# EAGLE design VentaConnected_ESP8266_V1.0_2018-10-06 (EAGLE 8.5.0)
VERSION: 0.01
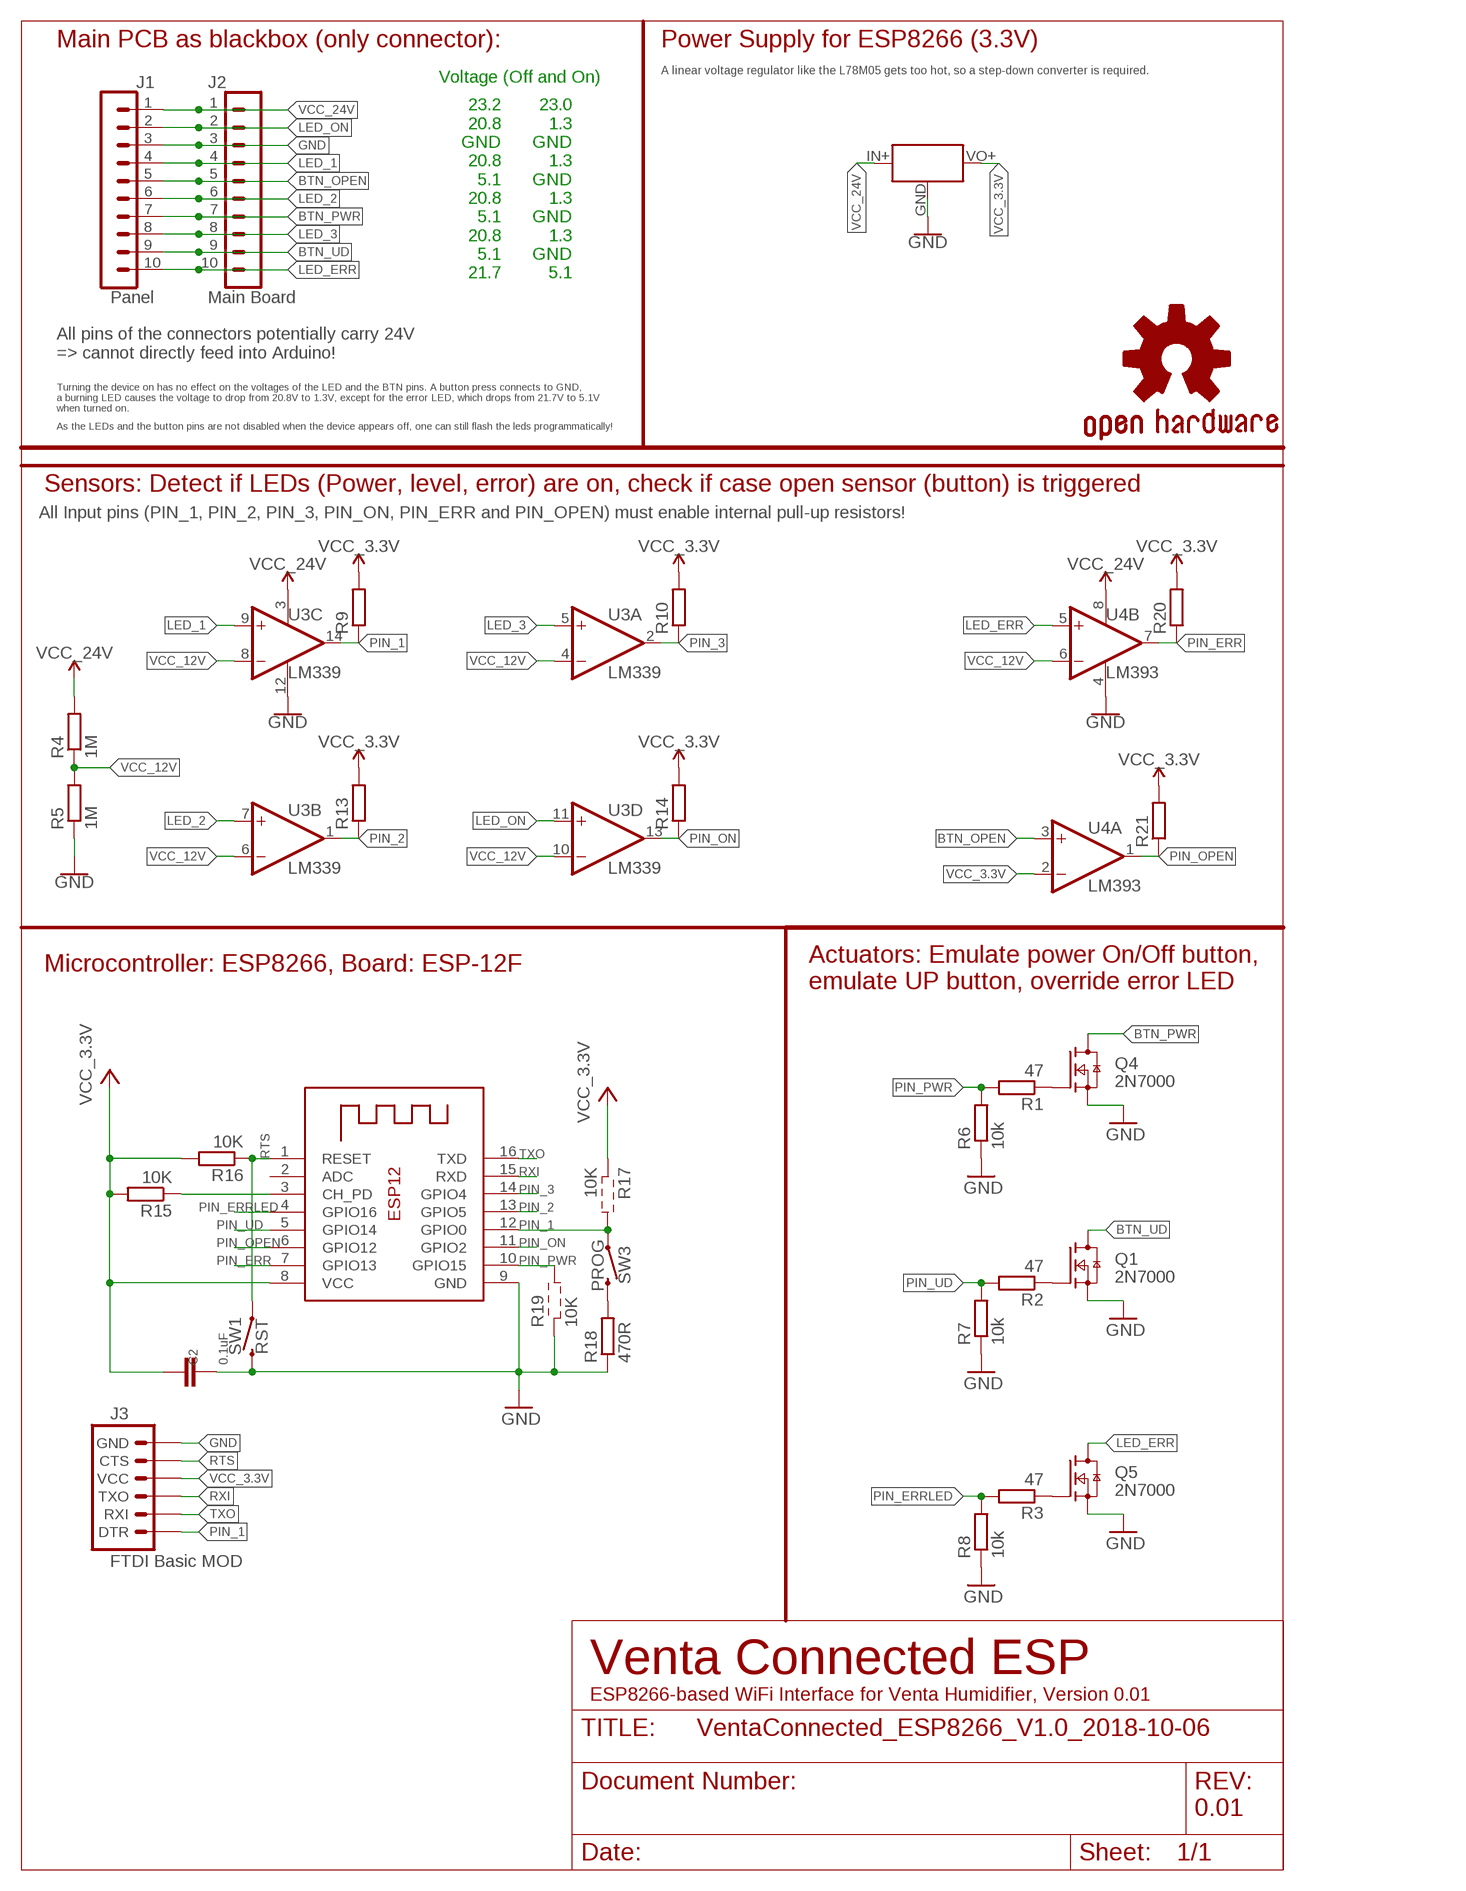
[diagram p0: schematic, sheet 1]

## Parts
C2  0.1uF  C-EUC0805  [C0805]
GOLD_ORB_SM1  OSHWLOGO_GOLD_ORB_SM  [OSHW2]
J1  Panel  CONN_05X2SHD  [2X5-SHROUDED]
J2  Main Board  CONN_05X2PTH  [2X5]
J3  FTDI Basic MOD  ARDUINO_SERIAL_PROGRAMPTH  [1X06]
Q1  2N7000  2N7002E  [SOT23]
Q4  2N7000  2N7002E  [SOT23]
Q5  2N7000  2N7002E  [SOT23]
R1  47  R-EU_R0805  [R0805]
R2  47  R-EU_R0805  [R0805]
R3  47  R-EU_R0805  [R0805]
R4  1M  R-EU_R0805  [R0805]
R5  1M  R-EU_R0805  [R0805]
R6  10k  R-EU_R0805  [R0805]
R7  10k  R-EU_R0805  [R0805]
R8  10k  R-EU_R0805  [R0805]
R9  R-EU_R0805  [R0805]
R10  R-EU_R0805  [R0805]
R13  R-EU_R0805  [R0805]
R14  R-EU_R0805  [R0805]
R15  10K  R-EU_R0805  [R0805]
R16  10K  R-EU_R0805  [R0805]
R17  10K  R-EU_HIDDEN  (no package)
R18  470R  R-EU_R0805  [R0805]
R19  10K  R-EU_HIDDEN  (no package)
R20  R-EU_R0805  [R0805]
R21  R-EU_R0805  [R0805]
SW1  RST  MOMENTARY-SWITCH-SPST-SMD-6.0X3.5MM  [TACTILE_SWITCH_SMD_6.0X3.5MM]
SW3  PROG  MOMENTARY-SWITCH-SPST-SMD-6.0X3.5MM  [TACTILE_SWITCH_SMD_6.0X3.5MM]
U2  3.3V_BUCK_CONVERTER  MINI_BUCK_CONVERTER_UPSIDEDOWN  [MINI_BUCK_CONVERTER_UPDOWN]
U3  LM339  TLC339D  [SO14]
U4  LM393  LM393D  [SO08]
X2  ESP-12e  ESP-12  [ESP-12]

## Nets
BTN_OPEN: J1.5 J2.5 U4.3(A:+IN)
BTN_PWR: J1.7 J2.7 Q4.3(D)
BTN_UD: J1.9 J2.9 Q1.3(D)
CH_PD: R15.1 X2.3(CH_PD)
GND: C2.1 J1.3 J2.3 J3.6(GND) Q1.2(S) Q4.2(S) Q5.2(S) R5.1 R6.1 R7.1 R8.1 R18.1 R19.1 SW1.2 U2.GND U3.12(P:V-) U4.4(P:V-) X2.9(GND)
LED_1: J1.4 J2.4 U3.9(C:+IN)
LED_2: J1.6 J2.6 U3.7(B:+IN)
LED_3: J1.8 J2.8 U3.5(A:+IN)
LED_ERR: J1.10 J2.10 Q5.3(D) U4.5(B:+IN)
LED_ON: J1.2 J2.2 U3.11(D:+IN)
N$2: Q4.1(G) R1.1
N$4: R18.2 SW3.2
N$5: Q5.1(G) R3.1
N$6: Q1.1(G) R2.1
PIN_1: J3.1(DTR) R9.1 R17.2 SW3.1 U3.14(C:OUT) X2.12(GPIO0)
PIN_2: R13.1 U3.1(B:OUT) X2.13(GPIO5)
PIN_3: R10.1 U3.2(A:OUT) X2.14(GPIO4)
PIN_ERR: R20.1 U4.7(B:OUT) X2.7(GPIO13)
PIN_ERRLED: R3.2 R8.2 X2.4(GPIO16)
PIN_ON: R14.1 U3.13(D:OUT) X2.11(GPIO2)
PIN_OPEN: R21.1 U4.1(A:OUT) X2.6(GPIO12)
PIN_PWR: R1.2 R6.2 R19.2 X2.10(GPIO15)
PIN_UD: R2.2 R7.2 X2.5(GPIO14)
RTS: J3.5(CTS) R16.1 SW1.1 X2.1(RESET)
RXI: J3.3(TXO) X2.15(RXD)
TXO: J3.2(RXI) X2.16(TXD)
VCC_3.3V: C2.2 J3.4(VCC) R9.2 R10.2 R13.2 R14.2 R15.2 R16.2 R17.1 R20.2 R21.2 U2.VO+(VOUT) U4.2(A:-IN) X2.8(VCC)
VCC_12V: R4.1 R5.2 U3.4(A:-IN) U3.6(B:-IN) U3.8(C:-IN) U3.10(D:-IN) U4.6(B:-IN)
VCC_24V: J1.1 J2.1 R4.2 U2.IN+(VIN) U3.3(P:V+) U4.8(P:V+)
Unconnected: X2.2(ADC)

## Notes on the sheet
- Main PCB as blackbox (only connector): | Power Supply for ESP8266 (3.3V)
- A linear voltage regulator like the L78M05 gets too hot, so a step-down converter is required.
- Voltage (Off and On)
- 23.2
  20.8
  GND
  20.8
  5.1
  20.8
  5.1
  20.8
  5.1
  21.7
- 23.0
  1.3
  GND
  1.3
  GND
  1.3
  GND
  1.3
  GND
  5.1
- All pins of the connectors potentially carry 24V 
  => cannot directly feed into Arduino!
- Turning the device on has no effect on the voltages of the LED and the BTN pins. A button press connects to GND, 
  a burning LED causes the voltage to drop from 20.8V to 1.3V, except for the error LED, which drops from 21.7V to 5.1V 
  when turned on.
- As the LEDs and the button pins are not disabled when the device appears off, one can still flash the leds programmatically!
- Sensors: Detect if LEDs (Power, level, error) are on, check if case open sensor (button) is triggered
- All Input pins (PIN_1, PIN_2, PIN_3, PIN_ON, PIN_ERR and PIN_OPEN) must enable internal pull-up resistors!
- Microcontroller: ESP8266, Board: ESP-12F
- Actuators: Emulate power On/Off button,
  emulate UP button, override error LED
- Venta Connected ESP
- ESP8266-based WiFi Interface for Venta Humidifier, Version 0.01

## Library data of the parts
C2 = resistor:C-EU: CAPACITOR, European symbol
GOLD_ORB_SM1 = bfl:OSHWLOGO: These are Open-Source Hardware logos.
J1 = opentools:CONN_05X2: Multi connection point. Often used as Generic Header-pin footprint for 0.1 inch spaced/style header connections For AVR SPI programming port, see special device with nice symbol: "AVR_SPI_PROG_5x2.dev" You can populate with any combo of single row headers, but if you'd like an exact match, check these: 2x5 AVR ICSP Male Header <https://www.sparkfun.com/products/778> (PRT-00778) 2x5 Pin Shrouded Header <https://www.sparkfun.com/products/8506> (PRT-08506) On any of the 0.1 inch spaced packages, you can populate with these: Break Away Headers - Straight <https://www.sparkfun.com/products/116> (PRT-00116) Break Away Male Headers - Right Angle <https://www.sparkfun.com/products/553> (PRT-00553) Female Headers <https://www.sparkfun.com/products/115> (PRT-00115) Break Away Headers - Machine Pin <https://www.sparkfun.com/products/117> (PRT-00117) Break Away Female Headers - Swiss Machine Pin <https://www.sparkfun.com/products/743> (PRT-00743) Special note: the shrouded connector mates well with our 5x2 ribbon cables: 2x5 Pin IDC Ribbon Cable <https://www.sparkfun.com/products/8535> (PRT-08535); PROD_ID: CONN-08671; SF_ID: PRT-08506
J2 = opentools:CONN_05X2: Multi connection point. Often used as Generic Header-pin footprint for 0.1 inch spaced/style header connections For AVR SPI programming port, see special device with nice symbol: "AVR_SPI_PROG_5x2.dev" You can populate with any combo of single row headers, but if you'd like an exact match, check these: 2x5 AVR ICSP Male Header <https://www.sparkfun.com/products/778> (PRT-00778) 2x5 Pin Shrouded Header <https://www.sparkfun.com/products/8506> (PRT-08506) On any of the 0.1 inch spaced packages, you can populate with these: Break Away Headers - Straight <https://www.sparkfun.com/products/116> (PRT-00116) Break Away Male Headers - Right Angle <https://www.sparkfun.com/products/553> (PRT-00553) Female Headers <https://www.sparkfun.com/products/115> (PRT-00115) Break Away Headers - Machine Pin <https://www.sparkfun.com/products/117> (PRT-00117) Break Away Female Headers - Swiss Machine Pin <https://www.sparkfun.com/products/743> (PRT-00743) Special note: the shrouded connector mates well with our 5x2 ribbon cables: 2x5 Pin IDC Ribbon Cable <https://www.sparkfun.com/products/8535> (PRT-08535); PROD_ID: CONN-08499; SF_ID: PRT-0778
J3 = SparkFun:ARDUINO_SERIAL_PROGRAM
Q1 Q4 Q5 = NXP_60_26022015:2N7002: N-channel TrenchMOS FET N-channel enhancement mode Field-Effect Transistor (FET) in a plastic package using TrenchMOS technology. AAL Eindhoven MK
R1-R10 R13 R14 R20 R21 = resistor:R-EU_: RESISTOR, European symbol
R15 R16 R18 = rcl:R-EU_: RESISTOR, European symbol; SPICEPREFIX: R
R17 = opentools:R-EU_HIDDEN
R19 = opentools:R-EU_HIDDEN; SPICEPREFIX: R
SW1 SW3 = SparkFun-Switches:MOMENTARY-SWITCH-SPST: Momentary Switch (Pushbutton) - SPST Normally-open (NO) SPST momentary switches (buttons, pushbuttons). Variants PTH-12MM - 12mm square, through-hole Momentary Pushbutton Switch - 12mm Square <https://www.sparkfun.com/products/9190> (COM-09190) PTH-6.0MM, PTH-6.0MM-KIT - 6.0mm square, through-hole Mini Pushbutton Switch <https://www.sparkfun.com/products/97> (COM-00097) KIT package intended for soldering kit's - only one side of pads' copper is exposed. PTH-RIGHT-ANGLE-KIT - Right-angle, through-hole Right Angle Tactile Button <https://www.sparkfun.com/products/10791> - Used on SparkFun BigTime Watch Kit <https://www.sparkfun.com/products/11734> SMD-12MM - 12mm square, surface-mount Tactile Button - SMD (12mm) <https://www.sparkfun.com/products/12993> (COM-12993) Used on SparkFun PicoBoard <https://www.sparkfun.com/products/11888> SMD-4.5MM - 4.5mm Square Trackball Switch Used on SparkFun Blackberry Trackballer Breakout <https://www.sparkfun.com/products/13169> SMD-4.6MMX2.8MM - 4.60mm x 2.80mm, surface mount Used on SparkFun SAMD21 Mini Breakout <https://www.sparkfun.com/products/13664> SMD-5.2MM, SMD-5.2-REDUNDANT - 5.2mm square, surface-mount Mini Pushbutton Switch - SMD <https://www.sparkfun.com/products/8720> (COM-08720) Used on Arduino Pro Mini <https://www.sparkfun.com/products/11114> REDUNDANT package connects both switch circuits together SMD-6.0X3.5MM - 6.0 x 3.5mm, surface mount Momentary Reset Switch SMD <https://www.sparkfun.com/products/8229> (COM-08229) SMD-6.2MM-TALL - 6.2mm square, surface mount Tactile Button - SMD (6mm) <https://www.sparkfun.com/products/12992> Used on SparkFun Digital Sandbox <https://www.sparkfun.com/products/12651> SMD-RIGHT-ANGLE - Right-angle, surface mount Used on SparkFun Block for Intel® Edison - Arduino <https://www.sparkfun.com/products/13036>; PROD_ID: SWCH-00815; SF_SKU: COM-08229
U2 = opentools:MINI_BUCK_CONVERTER: 4.5-40V Step Down Buck Converter
U3 = linear:TLC339: COMPARATOR
U4 = linear:LM393: COMPARATOR
X2 = adafruit:ESP-12

## Net classes
0 default: width 0.203 mm
1 vcc: width 0.254 mm

## Board
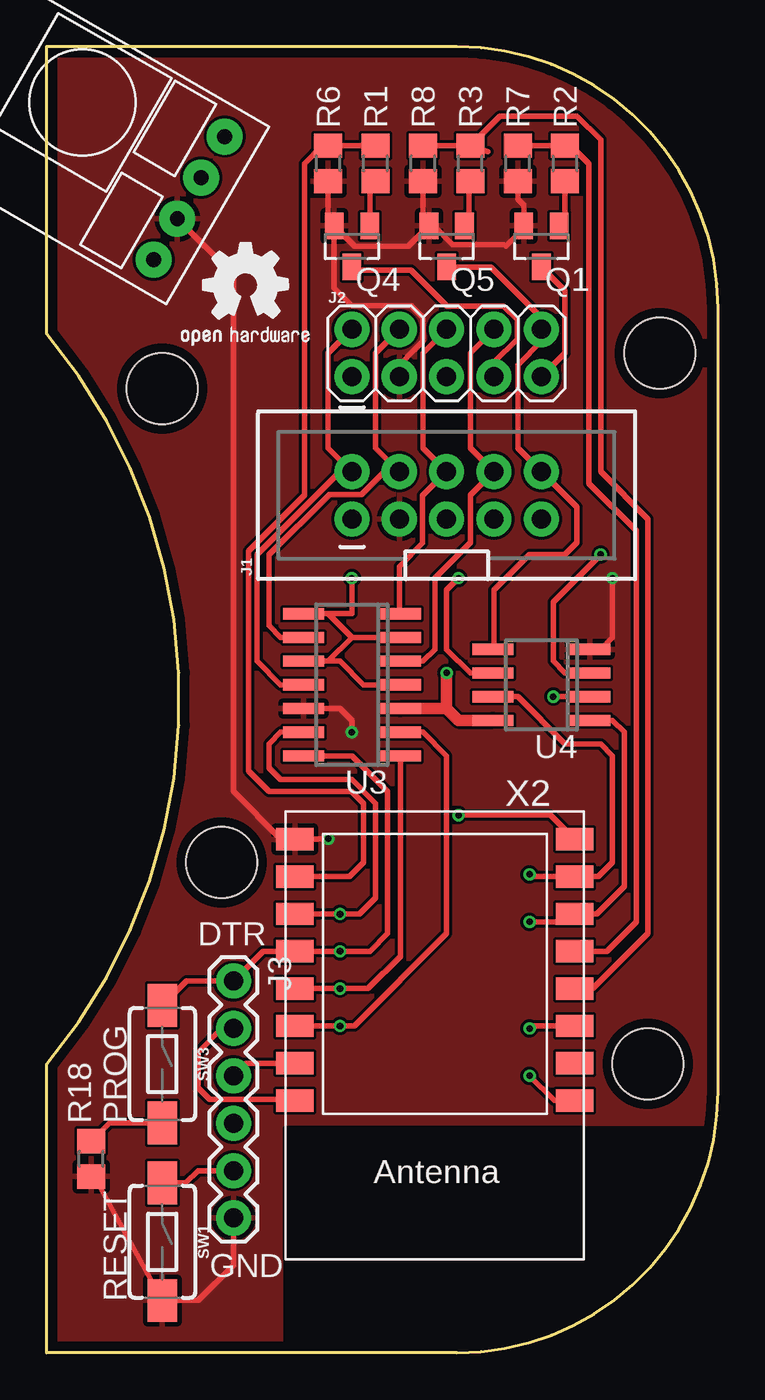
[diagram p1: board, top side]
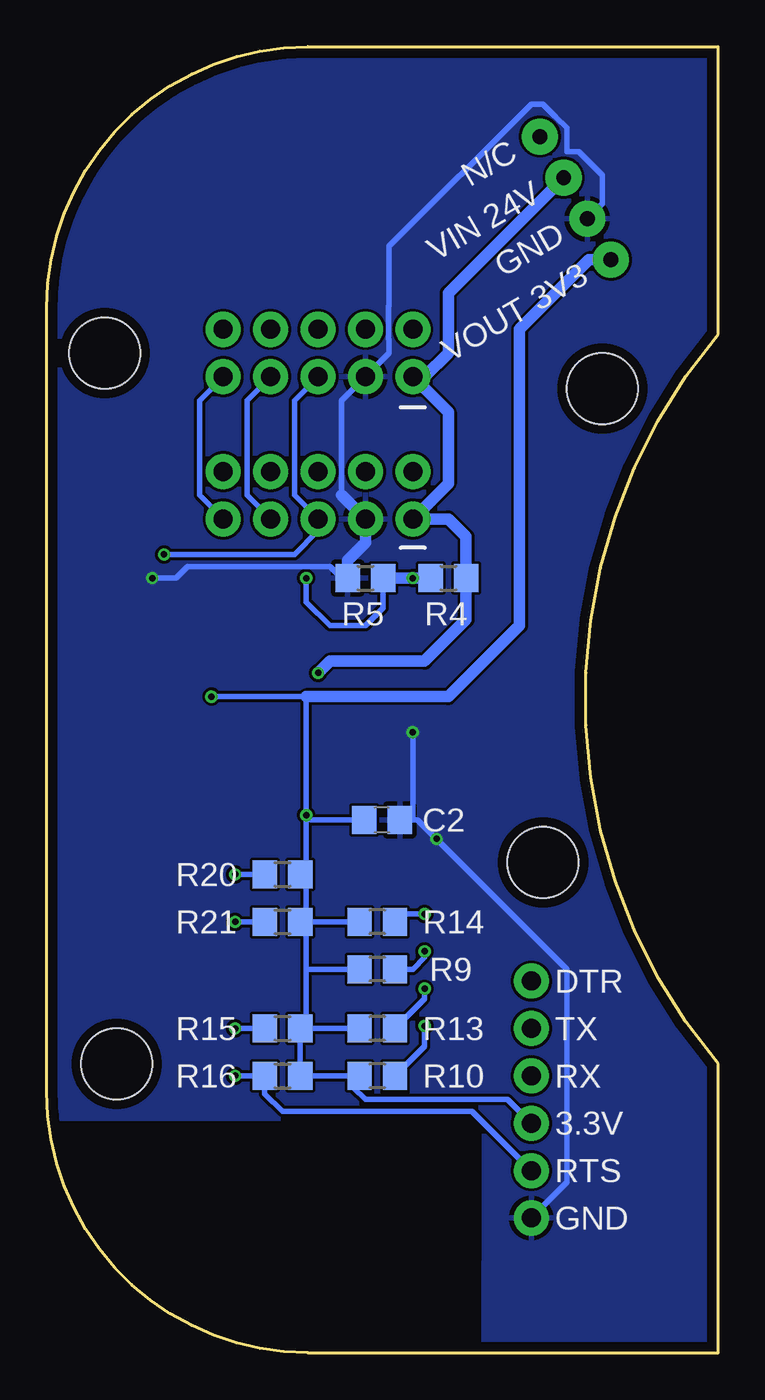
[diagram p2: board, bottom side, seen from below]

Size 35.99 x 70 mm. Coordinates in mm from the lower left corner, seen from the top.
Outline: 21.99,0 arc90 35.99,14 35.99,56 arc90 21.99,70 0,70 0,54.6 arc-80 0,15.48 0,0 21.99,0
Copper layers (1*16): Top 0.035mm / dielectric 1.6mm / Bottom 0.035mm
Design rules "Elecrow_2-layer_PCB_eagle_rule": minimum track width 6mil, minimum drill 12mil, track to track 6mil, track to pad 6mil, pad to pad 6mil, via to via 8mil, smd to smd 0mil, copper to edge 20mil, drill to drill 10mil, minimum pad ring 6mil, minimum via ring 6mil, stop-mask expansion 0mil, vias tented up to drill 100mil, thermal gap 10mil
Holes 3.81 mm at 6.2,51.67 32.87,53.58 32.24,15.48 9.38,26.27

### Footprints (pad centres in the part's own frame; a part is rotated, then mirrored left to right if it is on the bottom)
C0805 = smd 1.3 x 1.5: 1 -0.95,0; 2 0.95,0
2X5-SHROUDED = drill 1.016 pad 1.88: 1 -1.27,5.08; 2 1.27,5.08; 3 -1.27,2.54; 4 1.27,2.54; 5 -1.27,0; 6 1.27,0; 7 -1.27,-2.54; 8 1.27,-2.54; 9 -1.27,-5.08; 10 1.27,-5.08
2X5 = drill 1.016 pad 1.88: 1 0,0; 2 0,2.54; 3 2.54,0; 4 2.54,2.54; 5 5.08,0; 6 5.08,2.54; 7 7.62,0; 8 7.62,2.54; 9 10.16,0; 10 10.16,2.54
1X06 = drill 1.016 pad 1.88: 1 0,0; 2 2.54,0; 3 5.08,0; 4 7.62,0; 5 10.16,0; 6 12.7,0
SOT23 = smd 1 x 1.4: 1 -0.95,-1.1; 2 0.95,-1.1; 3 0,1.1
R0805 = smd 1.3 x 1.5: 1 -0.95,0; 2 0.95,0
TACTILE_SWITCH_SMD_6.0X3.5MM = smd 2.3 x 1.6: 1 -3.15,0; 2 3.15,0
MINI_BUCK_CONVERTER_UPDOWN = drill 0.8 pad 1.93: EN -1.27,1.27; GND -6.35,1.27; IN+ -3.81,1.27; VO+ -8.89,1.27
SO14 = smd 0.6 x 2.2: 1 -3.81,-2.6; 2 -2.54,-2.6; 3 -1.27,-2.6; 4 0,-2.6; 5 1.27,-2.6; 6 2.54,-2.6; 7 3.81,-2.6; 8 3.81,2.6; 9 2.54,2.6; 10 1.27,2.6; 11 0,2.6; 12 -1.27,2.6; 13 -2.54,2.6; 14 -3.81,2.6
SO08 = smd 0.6 x 2.2: 1 -1.905,-2.6; 2 -0.635,-2.6; 3 0.635,-2.6; 4 1.905,-2.6; 5 1.905,2.6; 6 0.635,2.6; 7 -0.635,2.6; 8 -1.905,2.6
ESP-12 = smd 2 x 1.2: 1 -7.5,4.5; 2 -7.5,2.5; 3 -7.5,0.5; 4 -7.5,-1.5; 5 -7.5,-3.5; 6 -7.5,-5.5; 7 -7.5,-7.5; 8 -7.5,-9.5; 9 7.5,-9.5; 10 7.5,-7.5; 11 7.5,-5.5; 12 7.5,-3.5; 13 7.5,-1.5; 14 7.5,0.5; 15 7.5,2.5; 16 7.5,4.5

### Placement (x,y rotation side)
C2  18.01,28.56 180 bottom
GOLD_ORB_SM1  6.84,52.94 0 top
J1  21.44,45.96 90 top
J2  16.36,52.31 0 top
J3  10.01,19.92 270 top
Q1  26.52,59.3 180 top
Q4  16.36,59.3 180 top
Q5  21.44,59.3 180 top
R1  17.63,63.74 90 top
R2  27.79,63.74 90 top
R3  22.71,63.74 90 top
R4  14.46,41.52 0 bottom
R5  18.9,41.52 0 bottom
R6  15.09,63.74 90 top
R7  25.25,63.74 90 top
R8  20.17,63.74 90 top
R9  18.27,20.56 180 bottom
R10  18.27,14.84 180 bottom
R13  18.27,17.38 180 bottom
R14  18.27,23.1 180 bottom
R15  23.35,17.38 0 bottom
R16  23.35,14.84 0 bottom
R18  2.39,10.4 90 top
R20  23.35,25.64 0 bottom
R21  23.35,23.1 0 bottom
SW1  6.2,5.95 270 top
SW3  6.2,15.48 270 top
U2  11.28,65.64 60 top
U3  16.36,35.8 90 top
U4  26.52,35.8 90 top
X2  20.81,18.02 180 top

### Tracks (layer width: path | path; a pad name or v marks a point on that pad's centre or on a via)
BTN_OPEN  (via drill 0.35)
  Top 0.305: v29.7,42.78 27.16,40.24 27.16,37.07 27.79,36.44 U4.3
  Bottom 0.305: J2.5 22.71,51.04 22.71,45.96 J1.5 21.44,44.05 22.71,42.78 v29.7,42.78
BTN_PWR
  Top 0.305: J2.7 23.98,53.09 25.23,54.33 25.23,55.37 24.5,56.09 21.47,56.09 19.54,58.03 17.63,58.03 16.53,58.03 Q4.3
  Bottom 0.305: J2.7 25.25,51.04 25.25,45.96 J1.7
BTN_UD
  Top 0.305: J2.9 27.79,53.58 27.79,56.92 Q1.3
  Bottom 0.305: J2.9 27.79,51.04 27.79,45.96 J1.9
CH_PD  (via drill 0.35)
  Top 0.305: v25.89,17.38 26.02,17.52 X2.3
  Bottom 0.305: R15.1 v25.89,17.38
GND  (via drill 0.35)
  Top 0.305: 13.33,27.55 v15.09,27.55 | 13.33,27.55 X2.9 | R18.1 2.74,9.11 SW1.2 8.13,2.8 10.01,4.68 J3.6 | J2.3 18.9,52.94 19.72,53.76 19.72,53.77 20.17,54.22 20.17,55.49 19.54,56.12 16.36,56.12 15.41,57.07 Q4.2 | v30.33,41.52 30.33,38.34 29.7,37.7 U4.4 | U3.12 15.73,34.53 16.36,33.9 v16.36,33.26 | U2.GND 10.01,57.78 10.01,30.09 12.55,27.55 13.33,27.55 | R7.1 25.25,61.83 25.57,61.52 Q1.2 25.57,60.25 24.62,59.3 24.52,59.39 21.77,59.39 20.76,60.39 Q5.2 | R8.1 20.17,60.72 Q5.2 | R6.1 15.09,60.72 Q4.2 | Q4.2 16.51,59.3 19.39,59.3 Q5.2
  Bottom 0.305: 20.17,45.96 20.17,51.04 J2.3 17.63,53.58 17.63,54.31 17.66,54.33 17.66,56.09 17.63,56.12 17.63,59.3 10.01,66.92 9.38,66.92 8.74,66.28 8.71,66.27 8.68,66.22 8.11,65.64 8.11,64.38 7.47,64.38 6.2,63.11 6.2,61.59 U2.GND | 16.36,28.56 C2.1 | 16.36,28.56 16.11,28.56 v15.09,27.55 8.11,20.56 8.11,9.13 J3.6 | v16.36,33.26 16.36,28.56 | R5.1 20.17,41.52 20.81,42.15 28.43,42.15 29.06,41.52 v30.33,41.52
  Bottom 0.61: R5.1 19.85,42.47 18.9,43.42 J1.3 20.17,45.96
  pour Top (isolate 0.152): -0.78,70.09 -0.15,56.12 -0.78,54.85 3.03,49.14 5.57,44.05 6.84,35.8 6.2,28.18 1.76,18.02 -0.78,14.84 -0.78,-1.03 12.55,-1.03 12.55,12.3 36.05,12.3 36.68,56.12 32.87,66.28 23.98,70.09
  pour Bottom (isolate 0.152): -0.78,70.34 -0.78,55.1 1.12,51.93 4.93,44.31 6.84,37.32 6.2,27.8 1.12,17.64 -0.78,15.1 -0.78,-0.78 10.01,-0.78 12.55,-0.14 12.55,12.56 36.05,12.56 36.68,55.74 32.87,65.9 23.98,69.71 12.55,69.71
LED_1
  Top 0.305: J2.4 17.63,53.58 17.63,48.5 J1.4 18.12,47.23 16.88,45.98 15.13,45.98 15.1,45.95 | 15.1,45.95 15.1,45.96 | 15.1,45.95 11.92,42.78 11.92,38.97 12.55,38.34 U3.9
LED_2
  Top 0.305: J2.6 20.17,53.58 20.17,48.5 J1.6 | J1.6 21.44,46.59 | J1.6 20.15,45.94 20.15,43.4 18.9,42.15 18.9,39.67 U3.7
LED_3
  Top 0.305: J2.8 22.71,53.58 22.71,48.5 J1.8 22.71,45.96 22.71,43.42 20.81,41.52 20.81,37.7 20.17,37.07 U3.5
LED_ERR
  Top 0.305: U4.5 23.98,37.77 23.98,40.88 25.89,42.78 27.79,42.78 28.43,43.42 28.43,45.33 J1.10 25.25,48.5 25.25,52.94 26.52,54.22 J2.10 26.52,55.48 23.81,58.19 Q5.3
LED_ON
  Top 0.305: J2.2 15.09,53.58 15.09,48.5 J1.2 15.73,47.23 11.28,42.78 11.28,37.07 12.55,35.8 U3.11
N$2
  Top 0.305: Q4.1 17.34,60.6 17.34,62.5 R1.1
N$4
  Top 0.305: R18.2 3.37,12.33 SW3.2
N$5
  Top 0.305: R3.1 22.64,62.72 22.64,61.2 22.64,60.64 Q5.1
N$6
  Top 0.305: R2.1 27.79,60.72 Q1.1
PIN_1  (via drill 0.35)
  Top 0.305: U3.14 16.36,31.99 18.27,30.09 18.27,22.47 17.32,21.52 v15.73,21.52 X2.12 11.61,21.52 J3.1 7.5,19.92 SW3.1
  Bottom 0.305: R9.1 16.36,20.56 15.73,21.2 v15.73,21.52
PIN_2  (via drill 0.35)
  Top 0.305: U3.1 18.96,21.26 17.23,19.52 v15.73,19.52 X2.13
  Bottom 0.305: R13.1 15.73,18.98 v15.73,19.52
PIN_3  (via drill 0.35)
  Top 0.305: U3.2 20.17,33.26 21.44,31.99 21.44,22.47 16.5,17.52 v15.73,17.52 X2.14
  Bottom 0.305: R10.1 15.73,16.43 v15.73,17.52
PIN_ERR  (via drill 0.35)
  Top 0.305: U4.7 25.25,35.16 27.79,32.62 29.7,32.62 30.33,31.99 30.33,26.27 29.58,25.52 X2.7 26.01,25.52 v25.89,25.64
  Bottom 0.305: v25.89,25.64 R20.1
PIN_ERRLED
  Top 0.305: R3.2 23.66,64.38 | X2.4 29.29,19.52 32.24,22.47 32.24,44.69 29.7,47.23 29.7,65.01 28.43,66.28 24.3,66.28 R3.2 | R8.2 R3.2
PIN_ON  (via drill 0.35)
  Top 0.305: U3.13 12.55,33.26 11.92,32.62 11.92,31.35 12.55,30.72 16.36,30.72 17.63,29.45 17.63,24.37 16.78,23.52 v15.73,23.52 X2.11
  Bottom 0.305: R14.1 16.9,23.52 v15.73,23.52
PIN_OPEN  (via drill 0.35)
  Top 0.305: U4.1 30.33,33.9 30.97,33.26 30.97,25.01 29.48,23.52 X2.6 27.89,23.1 v25.89,23.1
  Bottom 0.305: R21.1 v25.89,23.1
PIN_PWR
  Top 0.305: X2.10 16.24,25.52 17,26.27 17,29.44 16.35,30.09 11.92,30.09 10.83,31.18 10.83,42.97 13.82,45.97 13.82,63.74 14.77,64.69 R6.2 R1.2
PIN_UD
  Top 0.305: X2.5 30.02,21.52 31.6,23.1 31.6,44.05 29.06,46.59 29.06,63.74 28.11,64.69 R2.2 R7.2
RTS  (via drill 0.35)
  Top 0.305: X2.1 27.21,13.52 v25.89,14.84 | SW1.1 7.45,9.11 8.11,9.77 J3.5
  Bottom 0.305: v25.89,14.84 R16.1 24.3,13.89 23.35,12.94 13.19,12.94 J3.5
RXI
  Top 0.305: X2.15 10.69,15.52 J3.3
TXO
  Top 0.305: J3.2 9.38,17.38 8.11,16.11 8.11,14.21 8.74,13.57 13.25,13.57 X2.16
VCC_3.3V  (via drill 0.35)
  Top 0.305: v22.08,28.81 27.01,28.81 X2.8 | U4.2 v27.16,35.16
  Bottom 0.305: R15.2 22.08,17.38 22.08,20.56 | v22.08,28.81 22.08,35.16 v27.16,35.16 | 22.08,23.42 22.08,20.56 | C2.2 21.82,28.56 v22.08,28.81 | R15.2 R16.2 19.54,14.84 | 22.08,23.42 arc90 R21.2 R14.2 | 22.08,23.42 22.08,25.64 | 22.08,25.64 v22.08,28.81 | R20.2 22.08,25.64 | R9.2 22.08,20.56 | R13.2 R15.2 | R10.2 19.54,14.84 | J3.4 11.28,13.57 18.9,13.57 19.54,14.21 19.54,14.84
  Bottom 0.61: U2.VO+ 6.92,58.58 10.65,54.85 10.65,38.98 14.46,35.16 22.08,35.16
VCC_12V  (via drill 0.35)
  Top 0.305: 15.09,39.61 16.36,38.34 | 16.36,38.34 U3.6 | 16.36,38.34 15.09,37.07 | 15.09,37.07 U3.10 | 15.09,37.07 15.73,37.07 17,35.8 U3.4 | v16.36,41.52 16.36,39.61 15.09,39.61 | 15.09,39.61 U3.8 | v22.08,41.52 21.44,40.88 21.44,37.7 22.71,36.44 U4.6
  Bottom 0.305: R5.2 17.95,39.92 18.9,38.98 20.81,38.98 22.08,40.24 v22.08,41.52
  Bottom 0.61: R4.1 v16.36,41.52 R5.2
VCC_24V  (via drill 0.35)
  Top 0.61: v21.44,36.44 21.44,34.53 | 21.44,34.53 U3.3 | 21.44,34.53 22.08,33.9 U4.8
  Bottom 0.61: U2.IN+ 14.46,56.8 14.46,53.58 15.73,52.31 J2.1 14.46,50.41 14.46,46.59 J1.1 14.46,44.69 13.51,43.74 R4.2 13.51,39.29 15.73,37.07 20.81,37.07 v21.44,36.44

### Text on the board
bOrigins: VentaConnected for ESP8266 / R. Kainhofer / Version 1.0, 06.10.2018
tNames: DTR | PROG | GND | RESET
bNames: N/C / VIN 24V / GND / VOUT 3V3 | DTR / TX / RX / 3.3V / RTS / GND